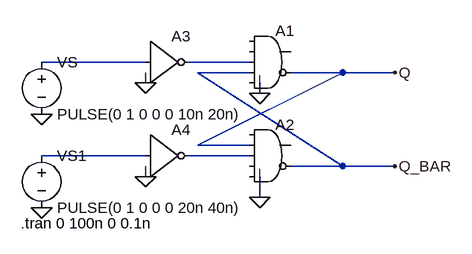
[diagram p0: schematic Latch-RS.asc]
Latch-RS.asc, the LTspice schematic file:
Version 4
SHEET 1 880 680
WIRE 32 112 -128 112
WIRE 192 112 96 112
WIRE 192 128 112 128
WIRE 336 128 256 128
WIRE 416 128 336 128
WIRE 32 144 32 128
WIRE 208 160 208 144
WIRE 112 240 336 128
WIRE 192 240 112 240
WIRE 32 256 -128 256
WIRE 192 256 96 256
WIRE 336 272 112 128
WIRE 336 272 256 272
WIRE 416 272 336 272
WIRE 32 288 32 272
WIRE 208 320 208 288
FLAG -128 192 0
FLAG -128 336 0
FLAG 416 128 Q
FLAG 416 272 Q_BAR
FLAG 32 144 0
FLAG 32 288 0
FLAG 208 160 0
FLAG 208 320 0
SYMBOL Digital\\and 224 48 R0
SYMATTR InstName A1
SYMBOL Digital\\and 224 192 R0
SYMATTR InstName A2
SYMBOL Digital\\inv 32 48 R0
SYMATTR InstName A3
SYMBOL Digital\\inv 32 192 R0
SYMATTR InstName A4
SYMBOL voltage -128 96 R0
WINDOW 123 0 0 Left 0
WINDOW 39 0 0 Left 0
SYMATTR InstName VS
SYMATTR Value PULSE(0 1 0 0 0 10n 20n)
SYMBOL voltage -128 240 R0
WINDOW 123 0 0 Left 0
WINDOW 39 0 0 Left 0
SYMATTR InstName VS1
SYMATTR Value PULSE(0 1 0 0 0 20n 40n)
TEXT -160 360 Left 2 !.tran 0 100n 0 0.1n

The netlist it stands for:
* Latch-RS.asc
A1 0 0 N002 Q_BAR 0 Q 0 0 AND
A2 0 Q N004 0 0 Q_BAR 0 0 AND
A3 N001 0 0 0 0 N002 0 0 BUF
A4 N003 0 0 0 0 N004 0 0 BUF
VS N001 0 PULSE(0 1 0 0 0 10n 20n)
VS1 N003 0 PULSE(0 1 0 0 0 20n 40n)
.tran 0 100n 0 0.1n
.backanno
.end